# EAGLE design StickIt-MPU (EAGLE 5.11)
AUTHOR: Dave Vandenbout / XESS Corp.; COPYRIGHT: 2013-2014 XESS Corp.; VERSION#: 1.0
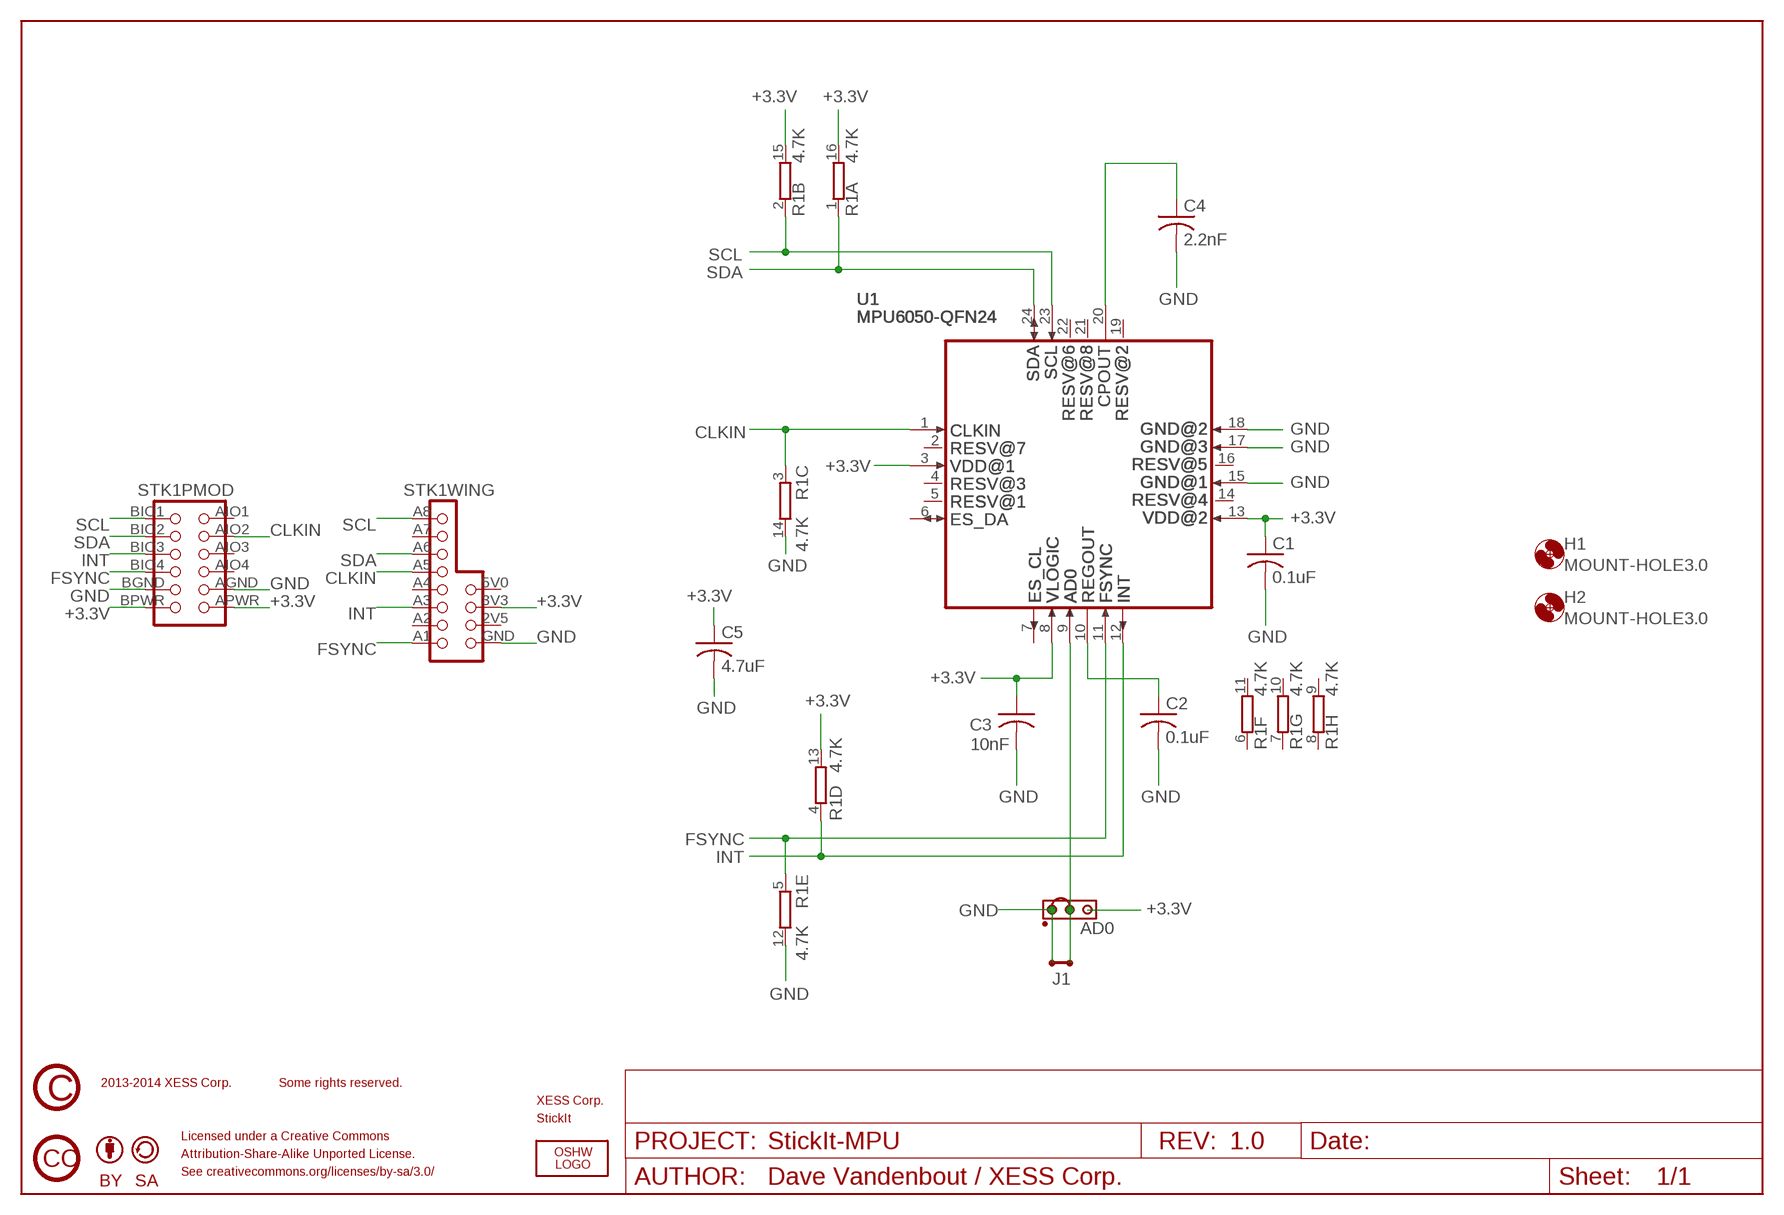
[diagram p0: schematic, sheet 1]

## Parts
AD0  JP2E  [JP2]
C1  0.1uF  C-USC0603  [C0603]
C2  0.1uF  C-USC0603  [C0603]
C3  10nF  C-USC0603  [C0603]
C4  2.2nF  C-USC0603  [C0603]
C5  4.7uF  C-USC0805  [C0805]
H1  MOUNT-HOLE3.0  [3,0]
H2  MOUNT-HOLE3.0  [3,0]
J1  JSHORTNORMAL  [JSHORT]
LOGO1  OSHW_LOGO_FILLX0200-NT  [OSHW_FILLX200_NOTEXT]
R1  4.7K  RES8742  [742C163]
STK1  STICKIT-HEADER  STICKIT-HEADER1  [STICKIT-HEADER1]
U1  MPU6050-QFN24  MPU9150-QFN24  [INVENSENSE-24_QFN]
U$1  LOGO-STICKIT700X200  [LOGO-STICKIT-700X200]
U$2  CC_CC  [CC_CC]
U$3  CC_BY  [CC_BY]
U$4  CC_SA  [CC_SA]
U$5  CC_COPYRIGHT  [CC_COPYRIGHT]
U$6  LOGO-XESS  LOGO-XESS700X120  [LOGO-XESS-700X120]

## Nets
+3.3V: AD0.3 C1.1 C3.1 C5.1 R1.13 R1.15 R1.16 STK1.3V3(WING:3V3) STK1.APWR(PMOD:APWR) STK1.BPWR(PMOD:BPWR) U1.3 U1.8 U1.13
CLKIN: R1.3 STK1.A5(WING:A5) STK1.AIO2(PMOD:AIO2) U1.1
FSYNC: R1.5 STK1.A1(WING:A1) STK1.BIO4(PMOD:BIO4) U1.11
GND: AD0.1 C1.2 C2.2 C3.2 C4.2 C5.2 J1.1 R1.12 R1.14 STK1.AGND(PMOD:AGND) STK1.BGND(PMOD:BGND) STK1.GND(WING:GND) U1.15 U1.17 U1.18
INT: R1.4 STK1.A3(WING:A3) STK1.BIO3(PMOD:BIO3) U1.12
N$1: C4.1 U1.20
N$2: C2.1 U1.10
N$3: AD0.2 J1.2 U1.9
SCL: R1.2 STK1.A8(WING:A8) STK1.BIO1(PMOD:BIO1) U1.23
SDA: R1.1 STK1.A6(WING:A6) STK1.BIO2(PMOD:BIO2) U1.24
Unconnected: R1.6 R1.7 R1.8 R1.9 R1.10 R1.11 STK1.2V5(WING:2V5) STK1.5V0(WING:5V) STK1.A2(WING:A2) STK1.A4(WING:A4) STK1.A7(WING:A7) STK1.AIO1(PMOD:AIO1) STK1.AIO3(PMOD:AIO3) STK1.AIO4(PMOD:AIO4) U1.2 U1.4 U1.5 U1.6 U1.7 U1.14 U1.16 U1.19 U1.21 U1.22

## Notes on the sheet
- Some rights reserved.
- Licensed under a Creative Commons
- Attribution-Share-Alike Unported License.
- See creativecommons.org/licenses/by-sa/3.0/

## Library data of the parts
AD0 = xess:JP2E: JUMPER
C1-C5 = rcl:C-US: CAPACITOR, American symbol
H1 H2 = holes:MOUNT-HOLE: MOUNTING HOLE with drill center marker
J1 = xess:JSHORT: Bridge
LOGO1 = oshw-logo:OSHW_LOGO_FILL
R1 = xess:RES8: Resistor 8-pack Package of eight resistors.; DIGIKEY#: 742C163???JPCT-ND; MANF: CTS Resistor Products; MANF#: 742C163???JPTR; MOUSER#: 774-742C163???JP
STK1 = xess:STICKIT-HEADER: StickIt Header Combined PMOD and Papilio Wing header for use on StickIt add-on boards.
U1 = xess:MPU9150: Invensense MPU9150 Invensense 9-Axis Gyro/Accelerometer/Compass.; DIGIKEY#: 1428-1009-1-ND; MANF: InvenSense; MANF#: MPU-9150
U$1 = xess:LOGO-STICKIT
U$2 = xess:CC_CC
U$3 = xess:CC_BY
U$4 = xess:CC_SA
U$5 = xess:CC_COPYRIGHT
U$6 = xess:LOGO-XESS

## Net classes
1 power: clearance 0.254 mm

## Board
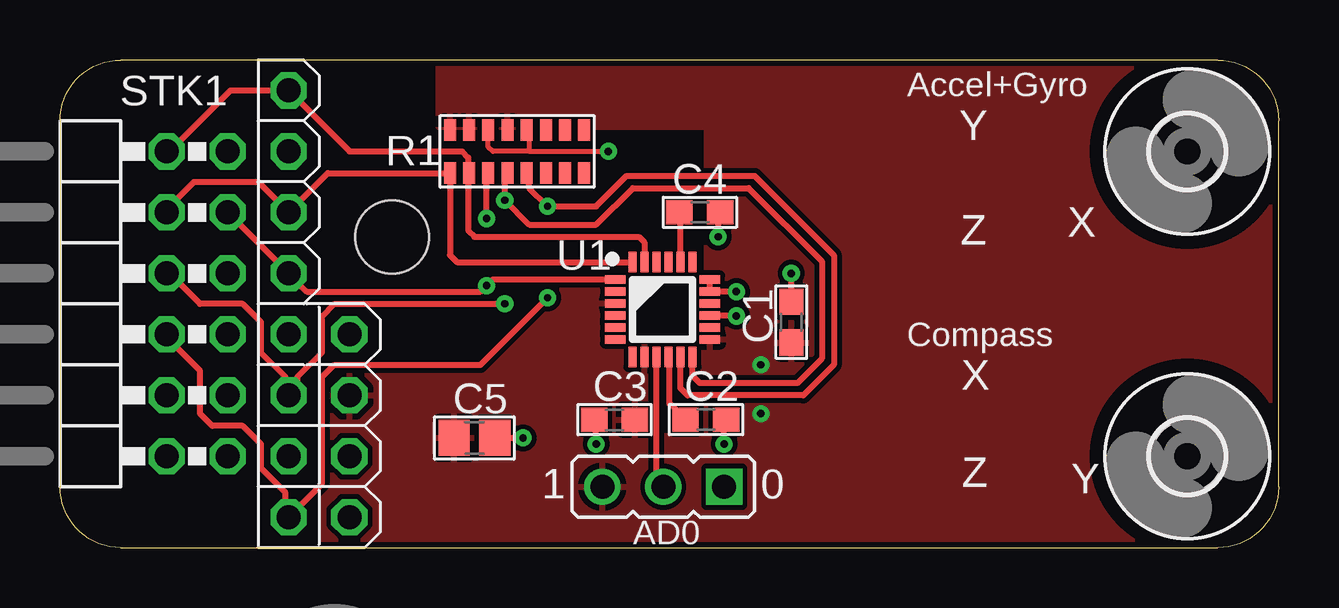
[diagram p1: board, top side]
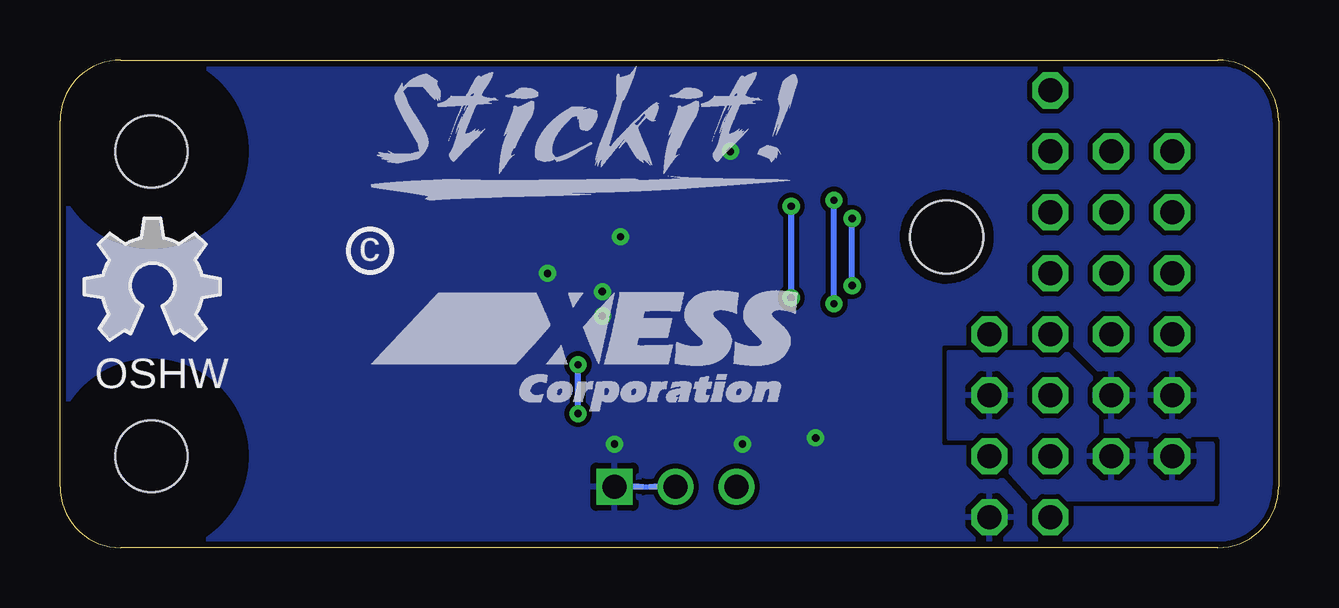
[diagram p2: board, bottom side, seen from below]

Size 50.8 x 20.32 mm. Coordinates in mm from the lower left corner, seen from the top.
Outline: 2.54,0 48.26,0 arc90 50.8,2.54 50.8,17.78 arc90 48.26,20.32 2.54,20.32 arc90 0,17.78 0,2.54 arc90 2.54,0
Copper layers (1*16): Top 0.035mm / dielectric 1.5mm / Bottom 0.035mm
Design rules "ITeadstudio_safe": minimum track width 8mil, minimum drill 12mil, track to track 8mil, track to pad 8mil, pad to pad 8mil, via to via 8mil, smd to smd 0mil, copper to edge 10mil, drill to drill 10mil, minimum pad ring 10mil, minimum via ring 8mil, stop-mask expansion 2mil, vias tented up to drill 100mil, thermal gap 10mil

### Footprints (pad centres in the part's own frame; a part is rotated, then mirrored left to right if it is on the bottom)
JP2 = drill 1 square: 1 -2.54,0 | drill 1 round: 2 0,0; 3 2.54,0
C0603 = smd 1.1 x 1: 1 -0.85,0; 2 0.85,0
C0805 = smd 1.3 x 1.5: 1 -0.85,0; 2 0.85,0
3,0 = hole 3: 0,0
JSHORT = smd 0.406 x 0.203: 1 0,0; 2 0.635,0
742C163 = smd 0.5 x 0.9: 1 -2.8,-0.9; 2 -2,-0.9; 3 -1.2,-0.9; 4 -0.4,-0.9; 5 0.4,-0.9; 6 1.2,-0.9; 7 2,-0.9; 8 2.8,-0.9; 9 2.8,0.9; 10 2,0.9; 11 1.2,0.9; 12 0.4,0.9; 13 -0.4,0.9; 14 -1.2,0.9; 15 -2,0.9; 16 -2.8,0.9
STICKIT-HEADER1 = drill 1 octagon: 2V5 5.08,-15.24; 3V3 5.08,-12.7; 5V0 5.08,-10.16; A1 2.54,-17.78; A2 2.54,-15.24; A3 2.54,-12.7; A4 2.54,-10.16; A5 2.54,-7.62; A6 2.54,-5.08; A7 2.54,-2.54; A8 2.54,0; AGND 0,-12.7; AIO1 0,-2.54; AIO2 0,-5.08; AIO3 0,-7.62; AIO4 0,-10.16; APWR 0,-15.24; BGND -2.54,-12.7; BIO1 -2.54,-2.54; BIO2 -2.54,-5.08; BIO3 -2.54,-7.62; BIO4 -2.54,-10.16; BPWR -2.54,-15.24; GND 5.08,-17.78 | hole 3.048: 6.858,-6.096
INVENSENSE-24_QFN = smd 0.85 x 0.34: 1 0.025,0; 2 0.025,-0.5; 3 0.025,-1; 4 0.025,-1.5; 5 0.025,-2; 6 0.025,-2.5; 13 3.975,-2.5; 14 3.975,-2; 15 3.975,-1.5; 16 3.975,-1; 17 3.975,-0.5; 18 3.975,0 | smd 0.34 x 0.85: 7 0.75,-3.225; 8 1.25,-3.225; 9 1.75,-3.225; 10 2.25,-3.225; 11 2.75,-3.225; 12 3.25,-3.225; 19 3.25,0.725; 20 2.75,0.725; 21 2.25,0.725; 22 1.75,0.725; 23 1.25,0.725; 24 0.75,0.725

### Placement (x,y rotation side)
AD0  25.15,2.54 180 top
C1  30.48,9.4 90 top
C2  26.92,5.33 0 top
C3  23.11,5.33 180 top
C4  26.67,13.97 0 top
C5  17.27,4.57 0 top
H1  46.99,3.81 0 top
H2  46.99,16.51 0 top
J1  26.67,2.54 0 bottom
LOGO1  49.78,8.64 0 bottom
R1  19.05,16.51 0 top
STK1  6.99,19.05 0 top
U1  23.11,11.18 0 top
U$1  37.85,14.48 0 bottom
U$2  11.43,-14.61 0 top  (outside the outline)
U$3  18.41,-13.34 0 top  (outside the outline)
U$4  23.5,-13.34 0 top  (outside the outline)
U$5  11.43,-5.71 0 top  (outside the outline)
U$6  37.85,7.62 0 bottom

### Tracks (layer width: path | path; a pad name or v marks a point on that pad's centre or on a via)
+3.3V  (via drill 0.3)
  Top 0.254: U1.13 27.13,8.64 | R1.15 17.02,17.41 | U1.8 24.38,7.95 | R1.16 | R1.13 18.8,17.41
  Bottom 0.254: v29.21,5.59 v29.21,7.62 29.12,7.71
  pour Bottom: 2.79,2.03 10.16,2.03 12.45,4.57 13.72,4.57 13.72,8.13 8.89,8.13 7.62,6.86 7.62,4.32 2.79,4.32
  pour Top (rank 2): 10.92,11.43 10.92,0 50.8,0 50.8,20.32 15.75,20.32 15.75,17.53 26.92,17.53 26.92,8.38 23.37,8.38 23.37,11.43
CLKIN  (via drill 0.3)
  Top 0.254: U1.1 18.03,11.18 v17.78,10.92 17.53,10.67 10.29,10.67 STK1.A5 STK1.AIO2 | v17.78,13.72 17.78,15.54 R1.3
  Bottom 0.254: v17.78,10.92 v17.78,13.72
FSYNC  (via drill 0.3)
  Top 0.254: U1.11 25.86,6.65 26.16,6.35 30.99,6.35 32.26,7.62 32.26,12.19 28.96,15.49 23.62,15.49 22.35,14.22 v20.32,14.22 19.56,14.99 19.56,15.5 R1.5 | v20.32,10.41 17.53,7.62 11.43,7.62 10.92,7.11 10.92,2.67 STK1.A1 9.4,1.4 9.4,2.29 8.38,3.3 8.38,4.32 7.62,5.08 6.35,5.08 5.84,5.59 5.84,7.37 4.45,8.76 STK1.BIO4
  Bottom 0.254: v20.32,10.41 v20.32,14.22
GND  (via drill 0.3)
  Top 0.203: R1.14 17.85,16.69 18.03,16.51 19.56,16.51 | 19.56,16.51 v22.86,16.51 | R1.12 19.56,17.41 19.56,16.51
  Top 0.254: C4.2 27.43,13.97 v27.43,12.95 | C1.2 v30.48,11.43 | C2.2 27.69,5.33 v27.69,4.32 | C3.2 22.35,5.33 v22.35,4.32 | U1.15 28.17,9.68 v28.19,9.65 | v28.19,10.67 v28.19,10.68 U1.17 U1.18 | C5.2 v19.3,4.57
  Bottom 0.254: J1.1 AD0.1
  pour Bottom (rank 6): 0,0 0,20.32 50.8,20.32 50.8,0
INT  (via drill 0.3)
  Top 0.254: U1.12 26.36,7.16 26.67,6.86 30.73,6.86 31.75,7.87 31.75,11.94 28.7,14.99 23.88,14.99 22.35,13.46 19.56,13.46 v18.54,14.48 18.54,15.5 R1.4 | v18.54,10.16 11.43,10.16 10.92,9.65 10.92,8.13 9.91,7.11 9.91,6.73 STK1.A3 9.4,6.48 9.4,7.11 8.38,8.13 8.38,9.4 7.62,10.16 5.84,10.16 4.57,11.43 STK1.BIO3
  Bottom 0.254: v18.54,10.16 v18.54,14.48
N$1
  Top 0.254: C4.1 25.86,13.97 U1.20
N$2
  Top 0.254: U1.10 25.4,7.95 25.4,6.01 C2.1
N$3
  Top 0.254: U1.9 24.86,2.82 AD0.2
  Bottom 0.254: AD0.2 J1.2
SCL
  Top 0.254: U1.23 24.36,12.72 24.13,12.95 17.27,12.95 17.02,13.21 17.02,15.58 | 17.02,15.58 R1.2 | STK1.BIO1 4.57,16.51 7.11,19.05 STK1.A8 12.06,16.51 16.76,16.51 17.02,16.26 17.02,15.58
SDA
  Top 0.254: U1.24 16.55,11.9 16.26,12.19 R1.1 11.16,15.61 STK1.A6 8.26,15.24 5.59,15.24 4.45,14.1 STK1.BIO2

### Text on the board
tPlace: Accel+Gyro | Y | Z | X | Compass | X | Z | 1 | 0 | Y
bPlace: c | OSHW
tDocu: Some rights reserved. | Licensed under a Creative Commons | Attribution-Share-Alike Unported License. | See creativecommons.org/licenses/by-sa/3.0/